# Altium project BalanceCar.PrjPcb
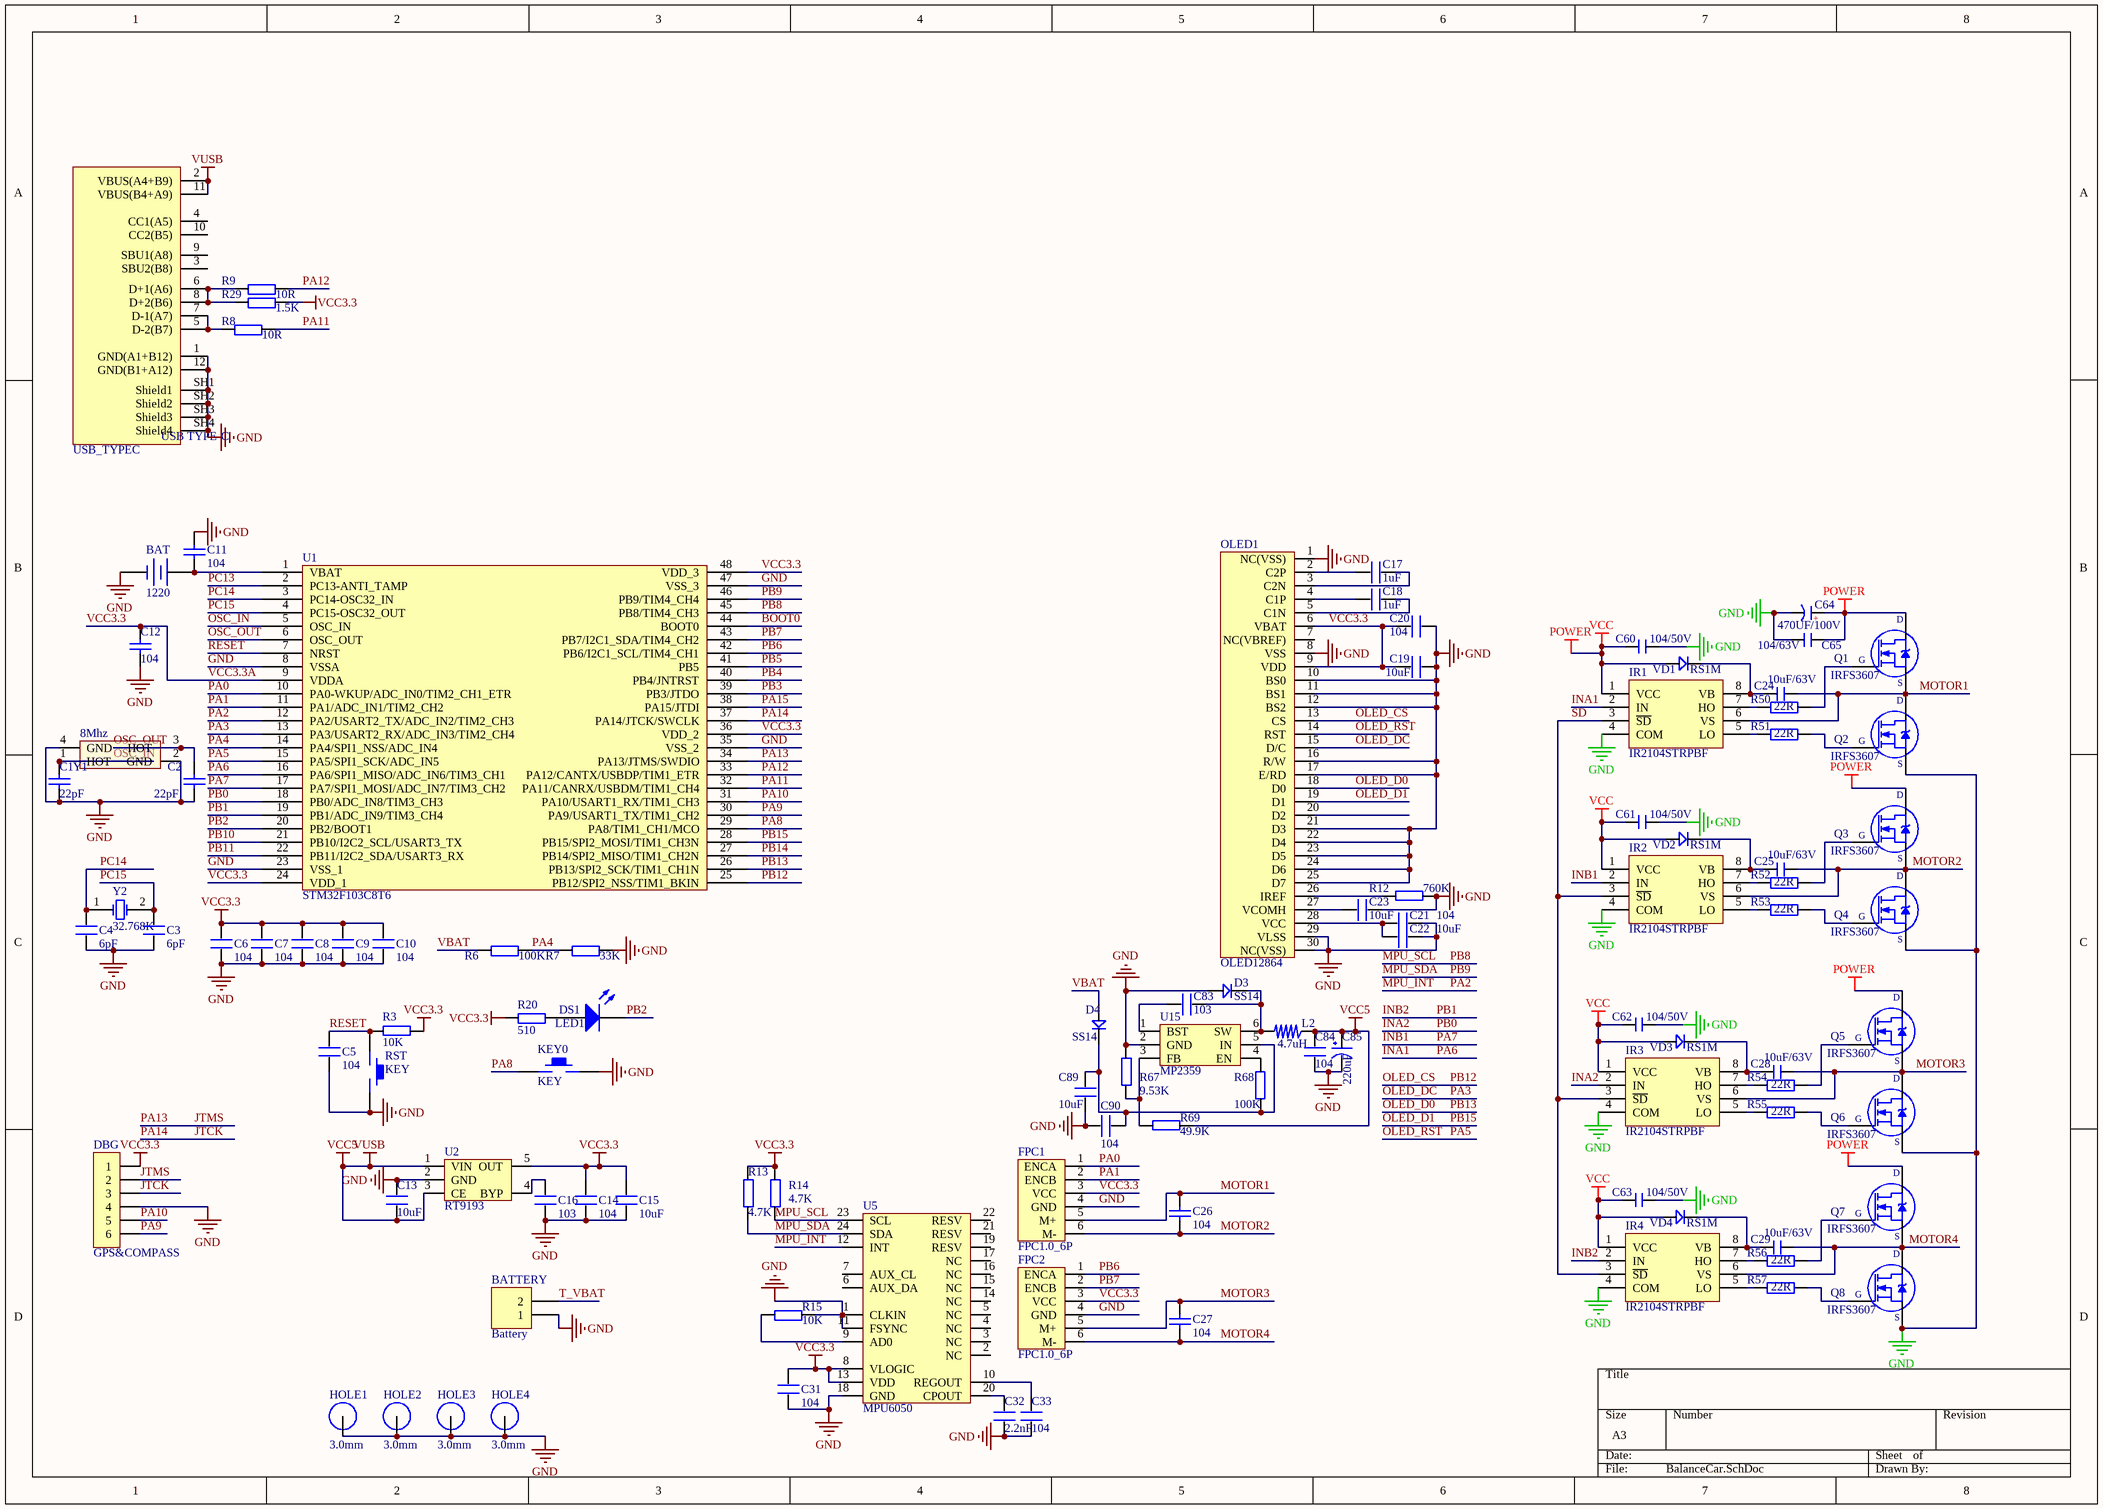
[diagram p0: BalanceCar.SchDoc]
1 sheet, 104 parts. Net scope: global (net labels, ports and power ports of the same name join across sheets).
Board file: BalanceCar.PcbDoc

## Sheet BalanceCar.SchDoc
size A3

### Parts
BAT  1220  [CR1220_B]
BATTERY  Battery  [HDR2.54-LI-2P]
C1  22pF  [C 0603_L]
C2  22pF  [C 0603_L]
C3  6pF  [C 0603_L]
C4  6pF  [C 0603_L]
C5  104  [C 0603_L]
C6  104  [C 0603_L]
C7  104  [C 0603_L]
C8  104  [C 0603_L]
C9  104  [C 0603_L]
C10  104  [C 0603_L]
C11  104  [C 0603_L]
C12  104  [C 0603_L]
C13  10uF  [C 0603_L]
C14  104  [C 0603_L]
C15  10uF  [C 0603_L]
C16  103  [C 0603_L]
C17  1uF  [C 0603_L]
C18  1uF  [C 0603_L]
C19  10uF  [C 0603_L]
C20  104  [C 0603_L]
C21  10uF  [C 0603_L]
C22  104  [C 0603_L]
C23  10uF  [C 0603_L]
C24  10uF/63V  [C 0603_L]
C25  10uF/63V  [C 0603_L]
C26  104  [C 0603_L]
C27  104  [C 0603_L]
C28  10uF/63V  [C 0603_L]
C29  10uF/63V  [C 0603_L]
C31  104  [C 0603_L]
C32  2.2nF  [C 0603_L]
C33  104  [C 0603_L]
C60  104/50V  [C 0603_L]
C61  104/50V  [C 0603_L]
C62  104/50V  [C 0603_L]
C63  104/50V  [C 0603_L]
C64  470UF/100V  [CAP 5.0*10*20 - BK]
C65  104/63V  [C 1206_L]
C83  103  [C 0603_L]
C84  104  [C 0603_L]
C85  220uF  [CM D(6.3*5.4)]
C89  10uF  [C 0603_L]
C90  104  [C 0603_L]
D3  SS14  [SMA]
D4  SS14  [SMA]
DBG  GPS&COMPASS  [SH1.0 S-W-6P]
DS1  LED1  [LED 0603R]
FPC1  FPC1.0_6P  [FPC_1.0_6P]
FPC2  FPC1.0_6P  [FPC_1.0_6P]
HOLE1  value 3.0mm  [HOLE-M3]  (hidden comment: HOLE)
HOLE2  value 3.0mm  [HOLE-M3]  (hidden comment: HOLE)
HOLE3  value 3.0mm  [HOLE-M3]  (hidden comment: HOLE)
HOLE4  value 3.0mm  [HOLE-M3]  (hidden comment: HOLE)
IR1  IR2104STRPBF  [SOP8_L]
IR2  IR2104STRPBF  [SOP8_L]
IR3  IR2104STRPBF  [SOP8_L]
IR4  IR2104STRPBF  [SOP8_L]
KEY0  KEY  [TSW DIP-6*6*9]
L2  4.7uH  [CDRH73]
OLED1  OLED12864
Q1  IRFS3607  [TO263-3B]
Q2  IRFS3607  [TO263-3B]
Q3  IRFS3607  [TO263-3B]
Q4  IRFS3607  [TO263-3B]
Q5  IRFS3607  [TO263-3B]
Q6  IRFS3607  [TO263-3B]
Q7  IRFS3607  [TO263-3B]
Q8  IRFS3607  [TO263-3B]
R3  10K  [R 0603_L]
R6  100K  [R 0603_L]
R7  33K  [R 0603_L]
R8  10R  [R 0603_L]
R9  10R  [R 0603_L]
R12  760K  [R 0603_L]
R13  4.7K  [R 0603_L]
R14  4.7K  [R 0603_L]
R15  10K  [R 0603_L]
R20  510  [R 0603_L]
R29  1.5K  [R 0603_L]
R50  22R  [R 0603_L]
R51  22R  [R 0603_L]
R52  22R  [R 0603_L]
R53  22R  [R 0603_L]
R54  22R  [R 0603_L]
R55  22R  [R 0603_L]
R56  22R  [R 0603_L]
R57  22R  [R 0603_L]
R67  9.53K  [R 0603_L]
R68  100K  [R 0603_L]
R69  49.9K  [R 0603_L]
RST  KEY  [TSW DIP-6*6*9]
U1  STM32F103C8T6  [LQFP-48PIN]
U2  RT9193  [SOT23-5L]
U5  MPU6050  [QFN24 4x4_N]
U15  MP2359  [SOT23-6L]
USB_TYPEC  USB TypeC  [USB Type-C]  (value not drawn)
VD1  RS1M  [SOD-123F]
VD2  RS1M  [SOD-123F]
VD3  RS1M  [SOD-123F]
VD4  RS1M  [SOD-123F]
Y1  8Mhz  [XTAL-3225]
Y2  32.768K  [OSC 3215-2P]

### Nets
GND: BAT.2(DC-) BATTERY.1 C1.1 C2.1 C3.1 C4.1 C5.1 C6.1 C7.1 C8.1 C9.1 C10.1 C11.2 C12.1 C13.2 C14.1 C15.1 C16.1 C19.1 C20.1 C21.1 C22.1 C23.1 C31.1 C32.1 C33.1 C60.1 C61.1 C62.1 C63.1 C64.2(K) C65.2 C84.1 C85.2(GND) C89.1 C90.1 D3.1 DBG.4 FPC1.4(GND) FPC2.4(GND) HOLE1.1 HOLE2.1 HOLE3.1 HOLE4.1 IR1.4(COM) IR2.4(COM) IR3.4(COM) IR4.4(COM) KEY0.2 OLED1.1(NC(VSS)) OLED1.8(VSS) OLED1.10(BS0) OLED1.11(BS1) OLED1.12(BS2) OLED1.16(R/W) OLED1.17(E/RD) OLED1.21(D3) OLED1.22(D4) OLED1.23(D5) OLED1.24(D6) OLED1.25(D7) OLED1.29(VLSS) OLED1.30(NC(VSS)) Q2.3(S) Q4.3(S) Q6.3(S) Q8.3(S) R7.2 R12.1 R15.2 R67.2 RST.2 U1.8(VSSA) U1.23(VSS_1) U1.35(VSS_2) U1.47(VSS_3) U2.2(GND) U5.1(CLKIN) U5.11(FSYNC) U5.18(GND) U15.2(GND) USB_TYPEC.1(GND(A1+B12)) USB_TYPEC.12(GND(B1+A12)) USB_TYPEC.SH1(Shield1) USB_TYPEC.SH2(Shield2) USB_TYPEC.SH3(Shield3) USB_TYPEC.SH4(Shield4) Y1.2(GND) Y1.4(GND)
POWER: C60.2 C61.2 C62.2 C63.2 C64.1(A) C65.1 IR1.1(VCC) IR2.1(VCC) IR3.1(VCC) IR4.1(VCC) Q1.2(D) Q3.2(D) Q5.2(D) Q7.2(D) VD1.1(A) VD2.1(A) VD3.1(A) VD4.1(A)  [also labelled VCC]
VCC3.3: C6.2 C7.2 C8.2 C9.2 C10.2 C12.2 C14.2 C15.2 C19.2 C20.2 C31.2 DBG.1 FPC1.3(VCC) FPC2.3(VCC) OLED1.6(VBAT) OLED1.9(VDD) R3.1 R13.2 R14.2 R20.1 R29.2 U1.9(VDDA) U1.24(VDD_1) U1.36(VDD_2) U1.48(VDD_3) U2.5(OUT) U5.8(VLOGIC) U5.13(VDD)  [also labelled VCC3.3A]
VCC5: C13.1 C84.2 C85.1(VCC) L2.1 R69.1 U2.1(VIN) U2.3(CE) USB_TYPEC.2(VBUS(A4+B9)) USB_TYPEC.11(VBUS(B4+A9))  [also labelled VUSB]
BOOT0: U1.44(BOOT0)
INA1: IR1.2(IN) U1.16(PA6/SPI1_MISO/ADC_IN6/TIM3_CH1)  [also labelled PA6]
INA2: IR3.2(IN) U1.18(PB0/ADC_IN8/TIM3_CH3)  [also labelled PB0]
INB1: IR2.2(IN) U1.17(PA7/SPI1_MOSI/ADC_IN7/TIM3_CH2)  [also labelled PA7]
INB2: IR4.2(IN) U1.19(PB1/ADC_IN9/TIM3_CH4)  [also labelled PB1]
JTCK: DBG.3 U1.37(PA14/JTCK/SWCLK)  [also labelled PA14]
JTMS: DBG.2 U1.34(PA13/JTMS/SWDIO)  [also labelled PA13]
MOTOR1: C24.1 C26.2 FPC1.5(M+) IR1.6(VS) Q1.3(S) Q2.2(D)
MOTOR2: C25.1 C26.1 FPC1.6(M-) IR2.6(VS) Q3.3(S) Q4.2(D)
MOTOR3: C27.2 C28.1 FPC2.5(M+) IR3.6(VS) Q5.3(S) Q6.2(D)
MOTOR4: C27.1 C29.1 FPC2.6(M-) IR4.6(VS) Q7.3(S) Q8.2(D)
MPU_INT: U1.12(PA2/USART2_TX/ADC_IN2/TIM2_CH3) U5.12(INT)  [also labelled PA2]
MPU_SCL: R14.1 U1.45(PB8/TIM4_CH3) U5.23(SCL)  [also labelled PB8]
MPU_SDA: R13.1 U1.46(PB9/TIM4_CH4) U5.24(SDA)  [also labelled PB9]
OLED_CS: OLED1.13(CS) U1.25(PB12/SPI2_NSS/TIM1_BKIN)  [also labelled PB12]
OLED_D0: OLED1.18(D0) U1.26(PB13/SPI2_SCK/TIM1_CH1N)  [also labelled PB13]
OLED_D1: OLED1.19(D1) U1.28(PB15/SPI2_MOSI/TIM1_CH3N)  [also labelled PB15]
OLED_DC: OLED1.15(D/C) U1.13(PA3/USART2_RX/ADC_IN3/TIM2_CH4)  [also labelled PA3]
OLED_RST: OLED1.14(RST) U1.15(PA5/SPI1_SCK/ADC_IN5)  [also labelled PA5]
OSC_IN: C1.2 U1.5(OSC_IN) Y1.1(HOT)
OSC_OUT: C2.2 U1.6(OSC_OUT) Y1.3(HOT)
PA0: FPC1.1(ENCA) U1.10(PA0-WKUP/ADC_IN0/TIM2_CH1_ETR)
PA1: FPC1.2(ENCB) U1.11(PA1/ADC_IN1/TIM2_CH2)
PA4: R6.2 R7.1 U1.14(PA4/SPI1_NSS/ADC_IN4)
PA8: KEY0.1 U1.29(PA8/TIM1_CH1/MCO)
PA9: DBG.6 U1.30(PA9/USART1_TX/TIM1_CH2)
PA10: DBG.5 U1.31(PA10/USART1_RX/TIM1_CH3)
PA11: R8.2 U1.32(PA11/CANRX/USBDM/TIM1_CH4)
PA12: R9.2 U1.33(PA12/CANTX/USBDP/TIM1_ETR)
PA15: U1.38(PA15/JTDI)
PB2: DS1.2(K) U1.20(PB2/BOOT1)
PB3: U1.39(PB3/JTDO)
PB4: U1.40(PB4/JNTRST)
PB5: U1.41(PB5)
PB6: FPC2.1(ENCA) U1.42(PB6/I2C1_SCL/TIM4_CH1)
PB7: FPC2.2(ENCB) U1.43(PB7/I2C1_SDA/TIM4_CH2)
PB10: U1.21(PB10/I2C2_SCL/USART3_TX)
PB11: U1.22(PB11/I2C2_SDA/USART3_RX)
PB14: U1.27(PB14/SPI2_MISO/TIM1_CH2N)
PC13: U1.2(PC13-ANTI_TAMP)
PC14: C4.2 U1.3(PC14-OSC32_IN) Y2.1(OSC1)
PC15: C3.2 U1.4(PC15-OSC32_OUT) Y2.2(OSC2)
RESET: C5.2 R3.2 RST.1 U1.7(NRST)
SD: IR1.3(~{SD}) IR2.3(~{SD}) IR3.3(~{SD}) IR4.3(~{SD})
T_VBAT: BATTERY.2
VBAT: D4.1 R6.1
NetBAT_1: BAT.1(DC+) C11.1 U1.1(VBAT)
NetC16_2: C16.2 U2.4(BYP)
NetC17_1: C17.1 OLED1.3(C2N)
NetC17_2: C17.2 OLED1.2(C2P)
NetC18_1: C18.1 OLED1.5(C1N)
NetC18_2: C18.2 OLED1.4(C1P)
NetC21_2: C21.2 C22.2 OLED1.28(VCC)
NetC23_2: C23.2 OLED1.27(VCOMH)
NetC24_2: C24.2 IR1.8(VB) VD1.2(K)
NetC25_2: C25.2 IR2.8(VB) VD2.2(K)
NetC28_2: C28.2 IR3.8(VB) VD3.2(K)
NetC29_2: C29.2 IR4.8(VB) VD4.2(K)
NetC32_2: C32.2 U5.20(CPOUT)
NetC33_2: C33.2 U5.10(REGOUT)
NetC83_1: C83.1 U15.1(BST)
NetC83_2: C83.2 D3.2 L2.2 U15.6(SW)
NetC89_2: C89.2 C90.2 D4.2 R68.2 U15.5(IN)
NetDS1_1: DS1.1(A) R20.2
NetIR1_5: IR1.5(LO) R51.2
NetIR1_7: IR1.7(HO) R50.2
NetIR2_5: IR2.5(LO) R53.2
NetIR2_7: IR2.7(HO) R52.2
NetIR3_5: IR3.5(LO) R55.2
NetIR3_7: IR3.7(HO) R54.2
NetIR4_5: IR4.5(LO) R57.2
NetIR4_7: IR4.7(HO) R56.2
NetOLED1_26: OLED1.26(IREF) R12.2
NetQ1_1: Q1.1(G) R50.1
NetQ2_1: Q2.1(G) R51.1
NetQ3_1: Q3.1(G) R52.1
NetQ4_1: Q4.1(G) R53.1
NetQ5_1: Q5.1(G) R54.1
NetQ6_1: Q6.1(G) R55.1
NetQ7_1: Q7.1(G) R56.1
NetQ8_1: Q8.1(G) R57.1
NetR8_1: R8.1 USB_TYPEC.5(D-2(B7)) USB_TYPEC.7(D-1(A7))
NetR9_1: R9.1 R29.1 USB_TYPEC.6(D+1(A6)) USB_TYPEC.8(D+2(B6))
NetR15_1: R15.1 U5.9(AD0)
NetR67_1: R67.1 R69.2 U15.3(FB)
NetR68_1: R68.1 U15.4(EN)

Not connected (* = marked no-connect by the designer): OLED1 7(NC(VBREF)) 20(D2); U5 2(NC) 3(NC) 4(NC) 5(NC) 6(AUX_DA) 7(AUX_CL) 14(NC) 15(NC) 16(NC) 17(NC) 19(RESV) 21(RESV) 22(RESV); USB_TYPEC 3(SBU2(B8)) 4(CC1(A5)) 9(SBU1(A8)) 10(CC2(B5))

### Notes on the sheet
- (in symbol C-CAP) +
- (in symbol USB Type-C) USB TYPE-C

### Library data of the parts
BAT = CR-3V: 微型电池; 版权归属: 源创客; BOM名称: 微型电池; 学习资源: www.ooocke.com
BATTERY = Header 2: Header, 2-Pin; LatestRevisionDate: 17-Jul-2002; LatestRevisionNote: Re-released for DXP Platform.; Publisher: Altium Limited
C1 C2 C11 C12 C26 C27 C85 = CAP
C3-C10 C13-C23 C31-C33 C83 C84 C89 C90 = C
C24 C25 C28 C29 C60-C63 C65 = C: 无极性贴片电容; 版权归属: 源创客; BOM名称: 无极性贴片电容; 学习资源: www.ooocke.com
C64 = C-CAP: 直插电解电容; 版权归属: 源创客; BOM名称: 直插电解电容; 学习资源: www.ooocke.com
D3 D4 = D: 1N4148
DBG = Header 6: 6P接插件; 版权归属: 源创客; BOM名称: 6P接插件; 学习资源: www.ooocke.com
DS1 = LED2: Typical RED, GREEN, YELLOW, AMBER GaAs LED; Published: 8-Jun-2000; LatestRevisionDate: 17-Jul-2002; LatestRevisionNote: Re-released for DXP Platform.; PackageDocument: Feb-2002; PackageReference: 3.2X1.6X1.1; Publisher: Altium Limited
FPC1 FPC2 = FPC
IR1-IR4 = IR2104STRPBF: HALF-BRIDGE DRIVER
KEY0 RST = KEY_M
L2 = L_SOP
Q1-Q8 = NMOS-2: N-Channel Power MOSFET; Note: Pin 2 is electrically connected to pin 4.; Published: 8-Jun-2000; LatestRevisionDate: 17-Jul-2002; LatestRevisionNote: Re-released for DXP Platform.; DatasheetVersion: PD-9.814; PackageVersion: Feb-1997; PackageReference: TO-220AB; Publisher: Altium Limited; PackageDescription: TO, Thru-Hole, Vertical, Heatsink Mounted; 3 In-Line Leads; Pitch 2.54 mm; ComponentLink1Description: Manufacturer Link; ComponentLink1URL: http://www.irf.com/
R3 R6-R9 R12-R15 R20 R29 R67-R69 = R
R50-R57 = R: 贴片电阻; 版权归属: 源创客; BOM名称: 贴片电阻; 学习资源: www.ooocke.com
U1 = U-STM32F103C8T6
U2 = CAT6219-330TD: 3.3V 500mA LDO
U5 = MPU6050: 9轴运动处理传感器
U15 = MP2359: DC DC Step Down IC
USB_TYPEC = USB Type-C: 12P TypeC 母座
VD1-VD4 = SS14: 肖特基二极管; 版权归属: 源创客; 属性: 40V/1A; BOM名称: 肖特基二极管; 学习资源: www.ooocke.com
Y1 = XTAL_3225: 3225贴片无源晶振
Y2 = XTAL: Crystal Oscillator; Published: 8-Jun-2000; LatestRevisionDate: 17-Jul-2002; LatestRevisionNote: Re-released for DXP Platform.; Publisher: Altium Limited